# EAGLE schematic LEDPanel (EAGLE 9.6.2)
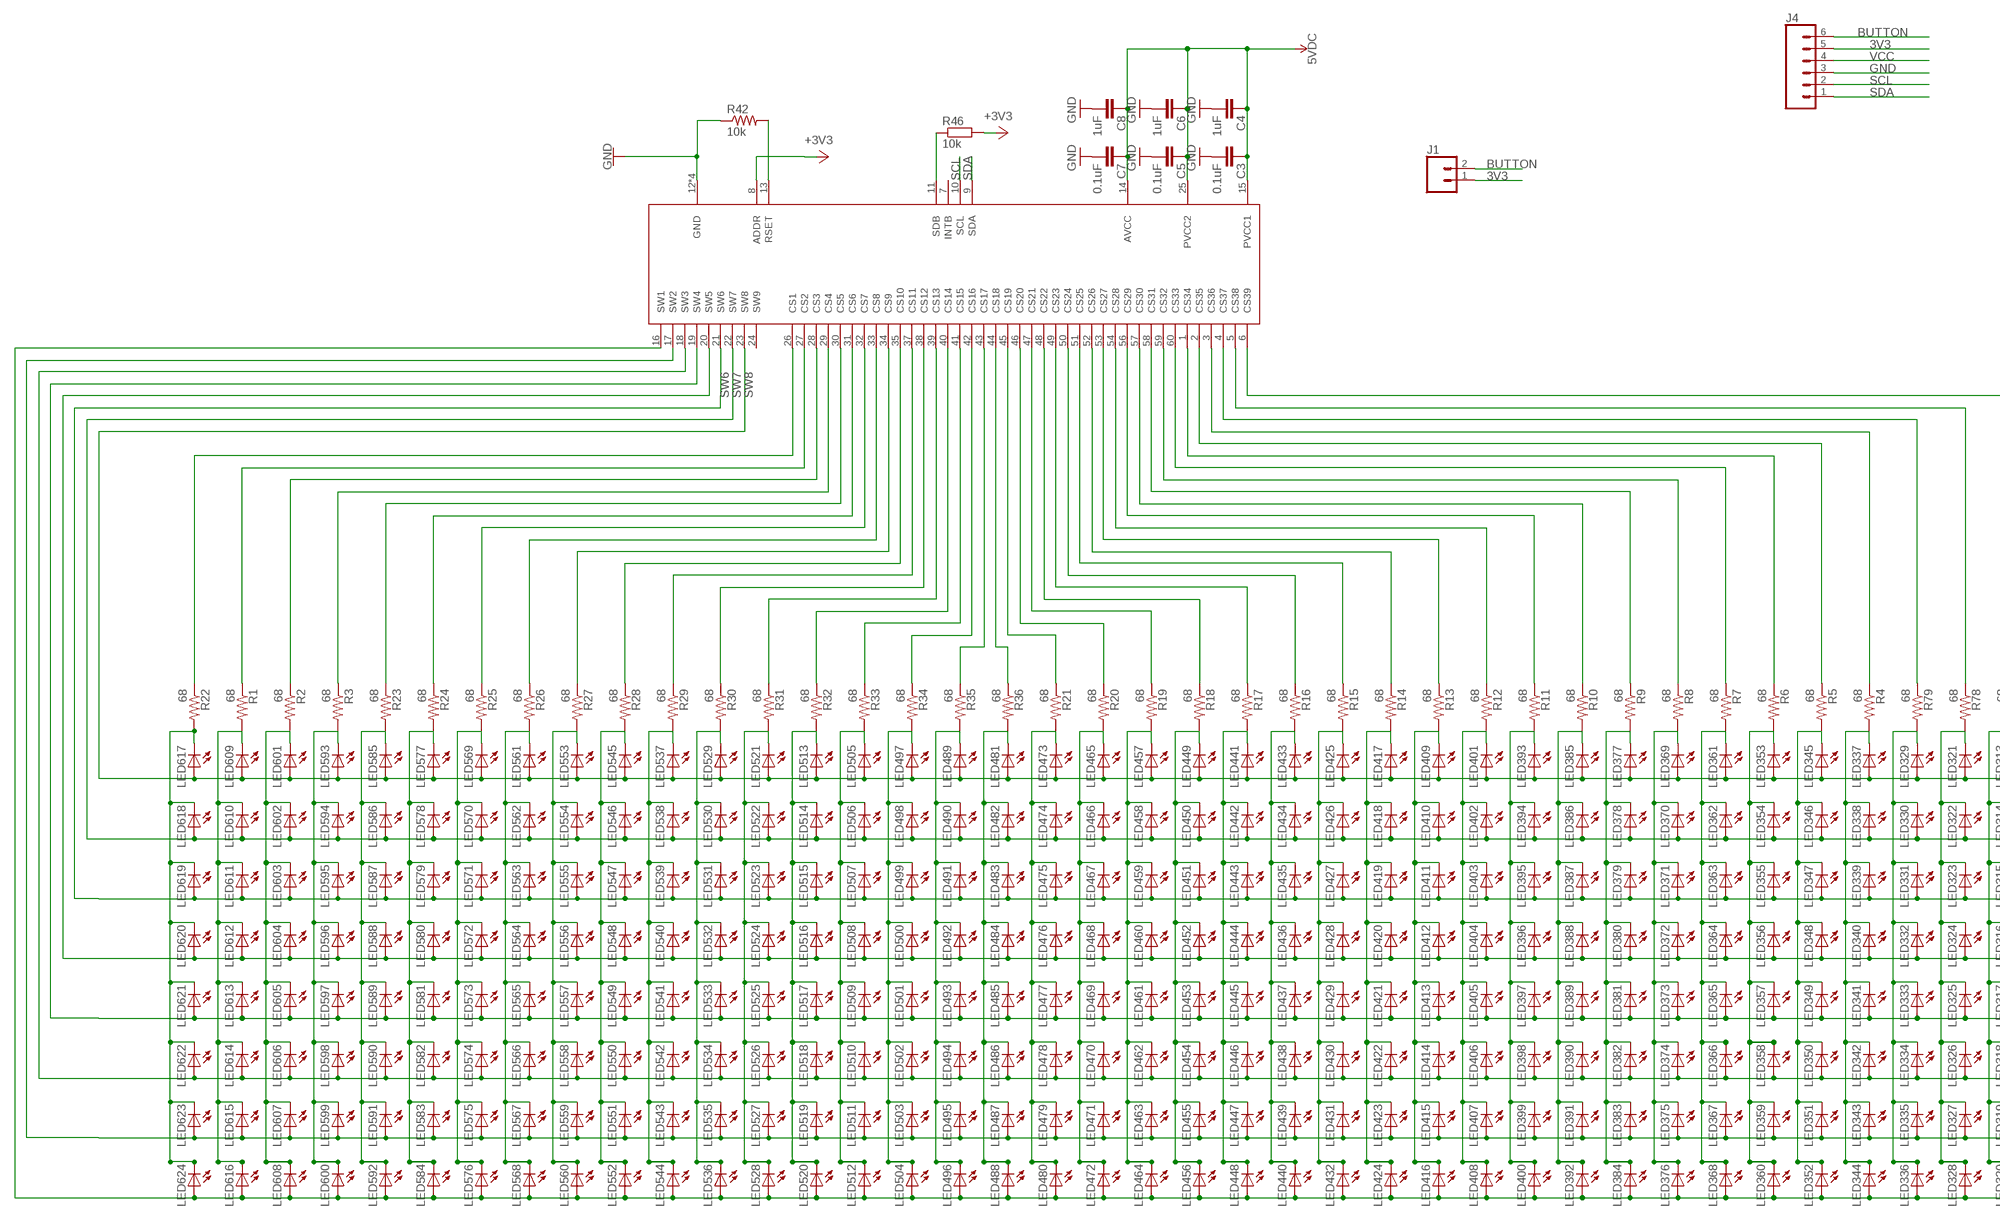
[diagram p0: schematic, sheet 1, part 1 of 2]
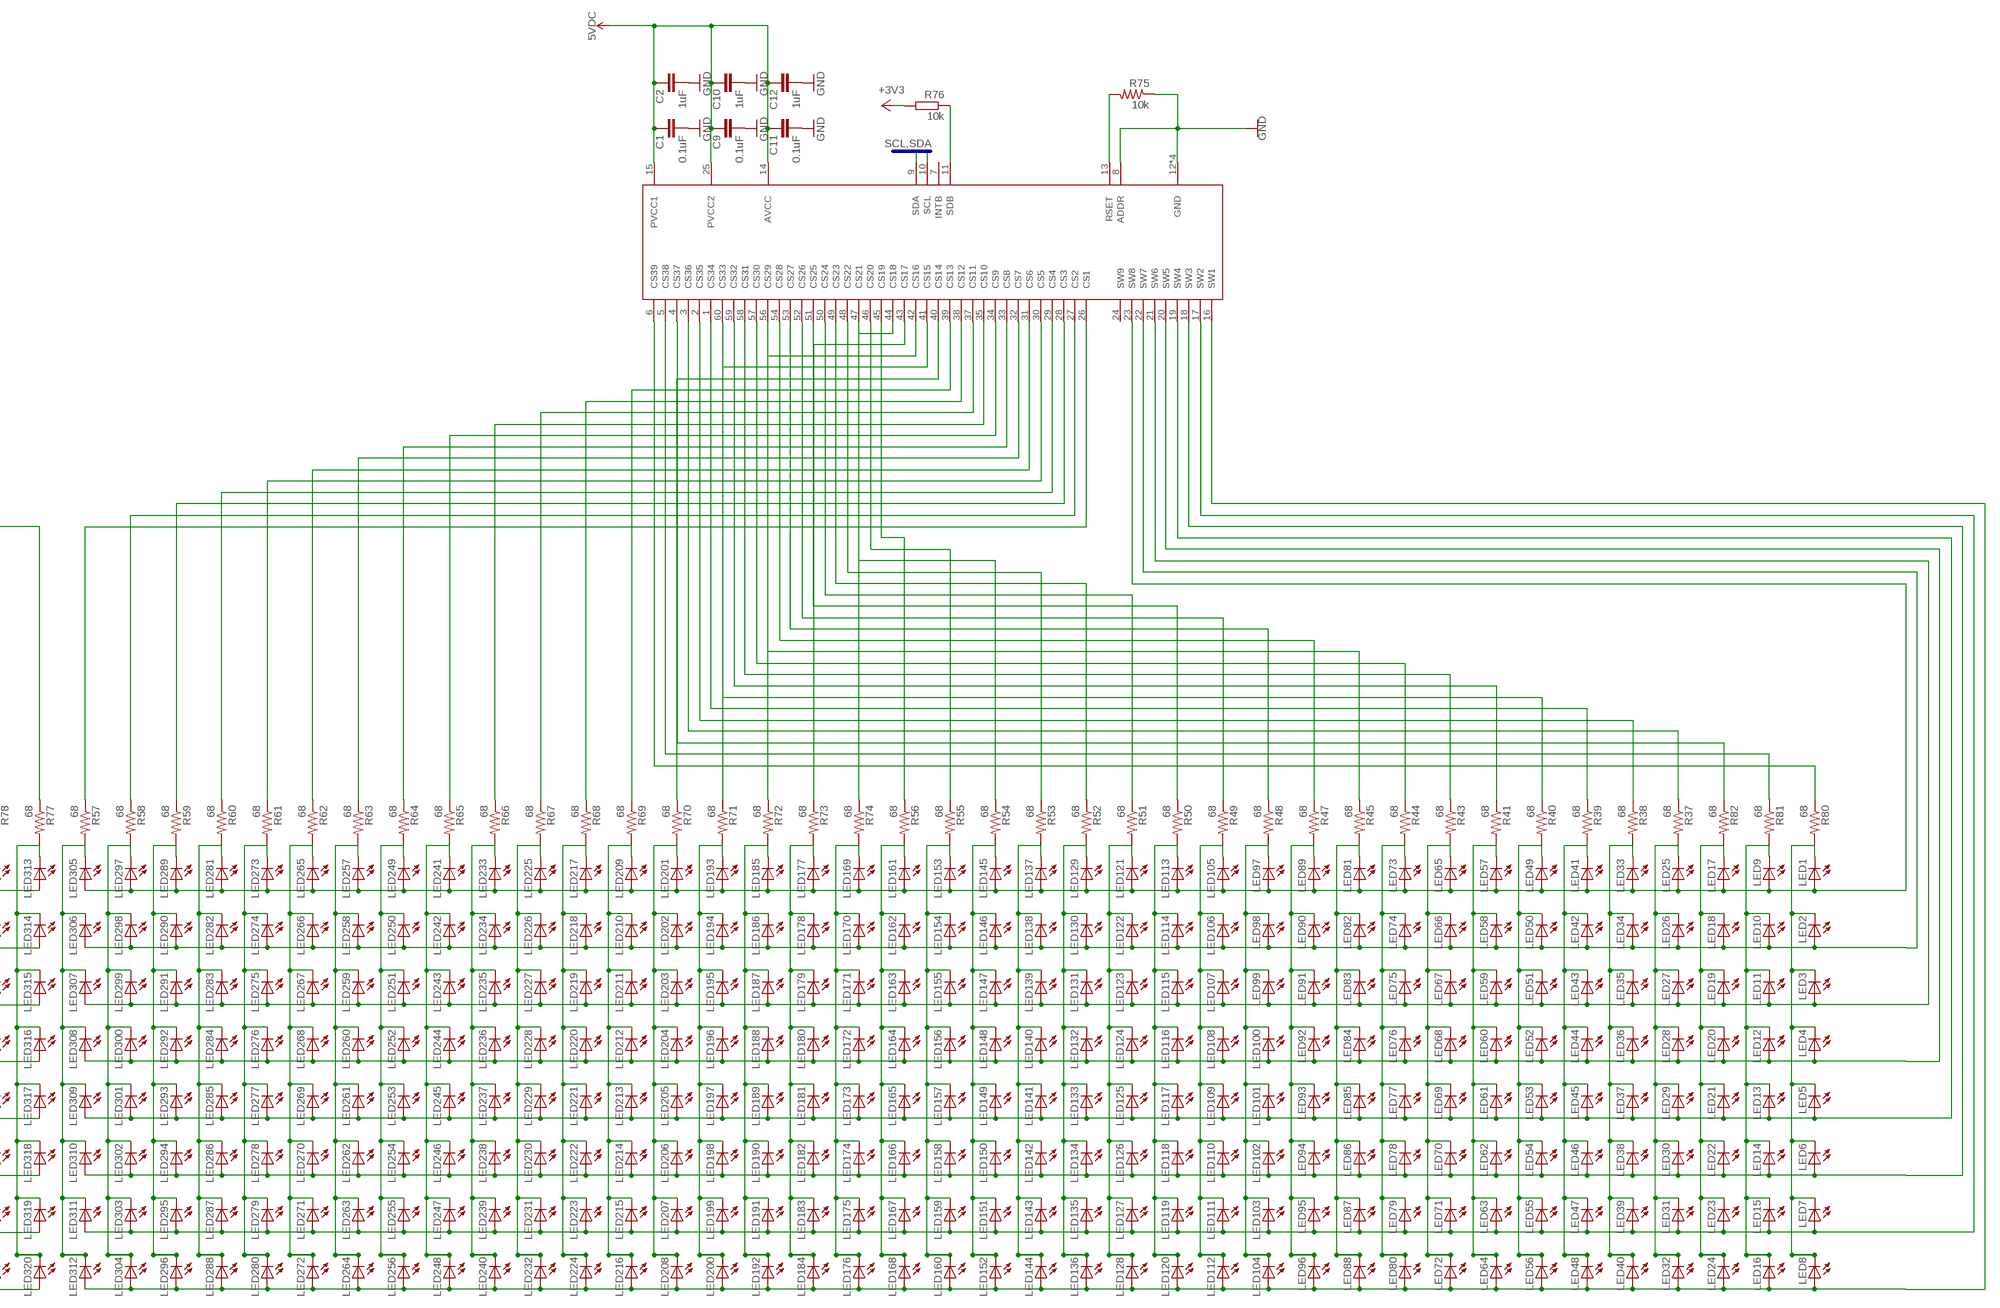
[diagram p1: schematic, sheet 1, part 2 of 2]

## Parts
C1  0.1uF  C-EUC0805K  [C0805K]
C2  1uF  C-EUC0805K  [C0805K]
C3  0.1uF  C-EUC0805K  [C0805K]
C4  1uF  C-EUC0805K  [C0805K]
C5  0.1uF  C-EUC0805K  [C0805K]
C6  1uF  C-EUC0805K  [C0805K]
C7  0.1uF  C-EUC0805K  [C0805K]
C8  1uF  C-EUC0805K  [C0805K]
C9  0.1uF  C-EUC0805K  [C0805K]
C10  1uF  C-EUC0805K  [C0805K]
C11  0.1uF  C-EUC0805K  [C0805K]
C12  1uF  C-EUC0805K  [C0805K]
J1  CONN_02LOCK  [1X02_LOCK]
J4  CONN_06LOCK  [1X06_LOCK]
LED1  LEDCHIP-LED0603  [CHIP-LED0603]
LED2  LEDCHIP-LED0603  [CHIP-LED0603]
LED3  LEDCHIP-LED0603  [CHIP-LED0603]
LED4  LEDCHIP-LED0603  [CHIP-LED0603]
LED5  LEDCHIP-LED0603  [CHIP-LED0603]
LED6  LEDCHIP-LED0603  [CHIP-LED0603]
LED7  LEDCHIP-LED0603  [CHIP-LED0603]
LED8  LEDCHIP-LED0603  [CHIP-LED0603]
LED9  LEDCHIP-LED0603  [CHIP-LED0603]
LED10  LEDCHIP-LED0603  [CHIP-LED0603]
LED11  LEDCHIP-LED0603  [CHIP-LED0603]
LED12  LEDCHIP-LED0603  [CHIP-LED0603]
LED13  LEDCHIP-LED0603  [CHIP-LED0603]
LED14  LEDCHIP-LED0603  [CHIP-LED0603]
LED15  LEDCHIP-LED0603  [CHIP-LED0603]
LED16  LEDCHIP-LED0603  [CHIP-LED0603]
LED17  LEDCHIP-LED0603  [CHIP-LED0603]
LED18  LEDCHIP-LED0603  [CHIP-LED0603]
LED19  LEDCHIP-LED0603  [CHIP-LED0603]
LED20  LEDCHIP-LED0603  [CHIP-LED0603]
LED21  LEDCHIP-LED0603  [CHIP-LED0603]
LED22  LEDCHIP-LED0603  [CHIP-LED0603]
LED23  LEDCHIP-LED0603  [CHIP-LED0603]
LED24  LEDCHIP-LED0603  [CHIP-LED0603]
LED25  LEDCHIP-LED0603  [CHIP-LED0603]
LED26  LEDCHIP-LED0603  [CHIP-LED0603]
LED27  LEDCHIP-LED0603  [CHIP-LED0603]
LED28  LEDCHIP-LED0603  [CHIP-LED0603]
LED29  LEDCHIP-LED0603  [CHIP-LED0603]
LED30  LEDCHIP-LED0603  [CHIP-LED0603]
LED31  LEDCHIP-LED0603  [CHIP-LED0603]
LED32  LEDCHIP-LED0603  [CHIP-LED0603]
LED33  LEDCHIP-LED0603  [CHIP-LED0603]
LED34  LEDCHIP-LED0603  [CHIP-LED0603]
LED35  LEDCHIP-LED0603  [CHIP-LED0603]
LED36  LEDCHIP-LED0603  [CHIP-LED0603]
LED37  LEDCHIP-LED0603  [CHIP-LED0603]
LED38  LEDCHIP-LED0603  [CHIP-LED0603]
LED39  LEDCHIP-LED0603  [CHIP-LED0603]
LED40  LEDCHIP-LED0603  [CHIP-LED0603]
LED41  LEDCHIP-LED0603  [CHIP-LED0603]
LED42  LEDCHIP-LED0603  [CHIP-LED0603]
LED43  LEDCHIP-LED0603  [CHIP-LED0603]
LED44  LEDCHIP-LED0603  [CHIP-LED0603]
LED45  LEDCHIP-LED0603  [CHIP-LED0603]
LED46  LEDCHIP-LED0603  [CHIP-LED0603]
LED47  LEDCHIP-LED0603  [CHIP-LED0603]
LED48  LEDCHIP-LED0603  [CHIP-LED0603]
LED49  LEDCHIP-LED0603  [CHIP-LED0603]
LED50  LEDCHIP-LED0603  [CHIP-LED0603]
LED51  LEDCHIP-LED0603  [CHIP-LED0603]
LED52  LEDCHIP-LED0603  [CHIP-LED0603]
LED53  LEDCHIP-LED0603  [CHIP-LED0603]
LED54  LEDCHIP-LED0603  [CHIP-LED0603]
LED55  LEDCHIP-LED0603  [CHIP-LED0603]
LED56  LEDCHIP-LED0603  [CHIP-LED0603]
LED57  LEDCHIP-LED0603  [CHIP-LED0603]
LED58  LEDCHIP-LED0603  [CHIP-LED0603]
LED59  LEDCHIP-LED0603  [CHIP-LED0603]
LED60  LEDCHIP-LED0603  [CHIP-LED0603]
LED61  LEDCHIP-LED0603  [CHIP-LED0603]
LED62  LEDCHIP-LED0603  [CHIP-LED0603]
LED63  LEDCHIP-LED0603  [CHIP-LED0603]
LED64  LEDCHIP-LED0603  [CHIP-LED0603]
LED65  LEDCHIP-LED0603  [CHIP-LED0603]
LED66  LEDCHIP-LED0603  [CHIP-LED0603]
LED67  LEDCHIP-LED0603  [CHIP-LED0603]
LED68  LEDCHIP-LED0603  [CHIP-LED0603]
LED69  LEDCHIP-LED0603  [CHIP-LED0603]
LED70  LEDCHIP-LED0603  [CHIP-LED0603]
LED71  LEDCHIP-LED0603  [CHIP-LED0603]
LED72  LEDCHIP-LED0603  [CHIP-LED0603]
LED73  LEDCHIP-LED0603  [CHIP-LED0603]
LED74  LEDCHIP-LED0603  [CHIP-LED0603]
LED75  LEDCHIP-LED0603  [CHIP-LED0603]
LED76  LEDCHIP-LED0603  [CHIP-LED0603]
LED77  LEDCHIP-LED0603  [CHIP-LED0603]
LED78  LEDCHIP-LED0603  [CHIP-LED0603]
LED79  LEDCHIP-LED0603  [CHIP-LED0603]
LED80  LEDCHIP-LED0603  [CHIP-LED0603]
LED81  LEDCHIP-LED0603  [CHIP-LED0603]
LED82  LEDCHIP-LED0603  [CHIP-LED0603]
LED83  LEDCHIP-LED0603  [CHIP-LED0603]
LED84  LEDCHIP-LED0603  [CHIP-LED0603]
LED85  LEDCHIP-LED0603  [CHIP-LED0603]
LED86  LEDCHIP-LED0603  [CHIP-LED0603]
LED87  LEDCHIP-LED0603  [CHIP-LED0603]
LED88  LEDCHIP-LED0603  [CHIP-LED0603]
LED89  LEDCHIP-LED0603  [CHIP-LED0603]
LED90  LEDCHIP-LED0603  [CHIP-LED0603]
LED91  LEDCHIP-LED0603  [CHIP-LED0603]
LED92  LEDCHIP-LED0603  [CHIP-LED0603]
LED93  LEDCHIP-LED0603  [CHIP-LED0603]
LED94  LEDCHIP-LED0603  [CHIP-LED0603]
LED95  LEDCHIP-LED0603  [CHIP-LED0603]
LED96  LEDCHIP-LED0603  [CHIP-LED0603]
LED97  LEDCHIP-LED0603  [CHIP-LED0603]
LED98  LEDCHIP-LED0603  [CHIP-LED0603]
LED99  LEDCHIP-LED0603  [CHIP-LED0603]
LED100  LEDCHIP-LED0603  [CHIP-LED0603]
LED101  LEDCHIP-LED0603  [CHIP-LED0603]
LED102  LEDCHIP-LED0603  [CHIP-LED0603]
LED103  LEDCHIP-LED0603  [CHIP-LED0603]
LED104  LEDCHIP-LED0603  [CHIP-LED0603]
LED105  LEDCHIP-LED0603  [CHIP-LED0603]
LED106  LEDCHIP-LED0603  [CHIP-LED0603]
LED107  LEDCHIP-LED0603  [CHIP-LED0603]
LED108  LEDCHIP-LED0603  [CHIP-LED0603]
LED109  LEDCHIP-LED0603  [CHIP-LED0603]
LED110  LEDCHIP-LED0603  [CHIP-LED0603]
LED111  LEDCHIP-LED0603  [CHIP-LED0603]
LED112  LEDCHIP-LED0603  [CHIP-LED0603]
LED113  LEDCHIP-LED0603  [CHIP-LED0603]
LED114  LEDCHIP-LED0603  [CHIP-LED0603]
LED115  LEDCHIP-LED0603  [CHIP-LED0603]
LED116  LEDCHIP-LED0603  [CHIP-LED0603]
LED117  LEDCHIP-LED0603  [CHIP-LED0603]
LED118  LEDCHIP-LED0603  [CHIP-LED0603]
LED119  LEDCHIP-LED0603  [CHIP-LED0603]
LED120  LEDCHIP-LED0603  [CHIP-LED0603]
LED121  LEDCHIP-LED0603  [CHIP-LED0603]
LED122  LEDCHIP-LED0603  [CHIP-LED0603]
LED123  LEDCHIP-LED0603  [CHIP-LED0603]
LED124  LEDCHIP-LED0603  [CHIP-LED0603]
LED125  LEDCHIP-LED0603  [CHIP-LED0603]
LED126  LEDCHIP-LED0603  [CHIP-LED0603]
LED127  LEDCHIP-LED0603  [CHIP-LED0603]
LED128  LEDCHIP-LED0603  [CHIP-LED0603]
LED129  LEDCHIP-LED0603  [CHIP-LED0603]
LED130  LEDCHIP-LED0603  [CHIP-LED0603]
LED131  LEDCHIP-LED0603  [CHIP-LED0603]
LED132  LEDCHIP-LED0603  [CHIP-LED0603]
LED133  LEDCHIP-LED0603  [CHIP-LED0603]
LED134  LEDCHIP-LED0603  [CHIP-LED0603]
LED135  LEDCHIP-LED0603  [CHIP-LED0603]
LED136  LEDCHIP-LED0603  [CHIP-LED0603]
LED137  LEDCHIP-LED0603  [CHIP-LED0603]
LED138  LEDCHIP-LED0603  [CHIP-LED0603]
LED139  LEDCHIP-LED0603  [CHIP-LED0603]
LED140  LEDCHIP-LED0603  [CHIP-LED0603]
LED141  LEDCHIP-LED0603  [CHIP-LED0603]
LED142  LEDCHIP-LED0603  [CHIP-LED0603]
LED143  LEDCHIP-LED0603  [CHIP-LED0603]
LED144  LEDCHIP-LED0603  [CHIP-LED0603]
LED145  LEDCHIP-LED0603  [CHIP-LED0603]
LED146  LEDCHIP-LED0603  [CHIP-LED0603]
LED147  LEDCHIP-LED0603  [CHIP-LED0603]
LED148  LEDCHIP-LED0603  [CHIP-LED0603]
LED149  LEDCHIP-LED0603  [CHIP-LED0603]
LED150  LEDCHIP-LED0603  [CHIP-LED0603]
LED151  LEDCHIP-LED0603  [CHIP-LED0603]
LED152  LEDCHIP-LED0603  [CHIP-LED0603]
LED153  LEDCHIP-LED0603  [CHIP-LED0603]
LED154  LEDCHIP-LED0603  [CHIP-LED0603]
LED155  LEDCHIP-LED0603  [CHIP-LED0603]
LED156  LEDCHIP-LED0603  [CHIP-LED0603]
LED157  LEDCHIP-LED0603  [CHIP-LED0603]
LED158  LEDCHIP-LED0603  [CHIP-LED0603]
LED159  LEDCHIP-LED0603  [CHIP-LED0603]
LED160  LEDCHIP-LED0603  [CHIP-LED0603]
LED161  LEDCHIP-LED0603  [CHIP-LED0603]
LED162  LEDCHIP-LED0603  [CHIP-LED0603]
LED163  LEDCHIP-LED0603  [CHIP-LED0603]
LED164  LEDCHIP-LED0603  [CHIP-LED0603]
LED165  LEDCHIP-LED0603  [CHIP-LED0603]
LED166  LEDCHIP-LED0603  [CHIP-LED0603]
LED167  LEDCHIP-LED0603  [CHIP-LED0603]
LED168  LEDCHIP-LED0603  [CHIP-LED0603]
LED169  LEDCHIP-LED0603  [CHIP-LED0603]
LED170  LEDCHIP-LED0603  [CHIP-LED0603]
LED171  LEDCHIP-LED0603  [CHIP-LED0603]
LED172  LEDCHIP-LED0603  [CHIP-LED0603]
LED173  LEDCHIP-LED0603  [CHIP-LED0603]
LED174  LEDCHIP-LED0603  [CHIP-LED0603]
LED175  LEDCHIP-LED0603  [CHIP-LED0603]
LED176  LEDCHIP-LED0603  [CHIP-LED0603]
LED177  LEDCHIP-LED0603  [CHIP-LED0603]
LED178  LEDCHIP-LED0603  [CHIP-LED0603]
LED179  LEDCHIP-LED0603  [CHIP-LED0603]
LED180  LEDCHIP-LED0603  [CHIP-LED0603]
LED181  LEDCHIP-LED0603  [CHIP-LED0603]
LED182  LEDCHIP-LED0603  [CHIP-LED0603]
LED183  LEDCHIP-LED0603  [CHIP-LED0603]
LED184  LEDCHIP-LED0603  [CHIP-LED0603]
LED185  LEDCHIP-LED0603  [CHIP-LED0603]
LED186  LEDCHIP-LED0603  [CHIP-LED0603]
LED187  LEDCHIP-LED0603  [CHIP-LED0603]
LED188  LEDCHIP-LED0603  [CHIP-LED0603]
LED189  LEDCHIP-LED0603  [CHIP-LED0603]
LED190  LEDCHIP-LED0603  [CHIP-LED0603]
LED191  LEDCHIP-LED0603  [CHIP-LED0603]
LED192  LEDCHIP-LED0603  [CHIP-LED0603]
LED193  LEDCHIP-LED0603  [CHIP-LED0603]
LED194  LEDCHIP-LED0603  [CHIP-LED0603]
LED195  LEDCHIP-LED0603  [CHIP-LED0603]
LED196  LEDCHIP-LED0603  [CHIP-LED0603]
LED197  LEDCHIP-LED0603  [CHIP-LED0603]
LED198  LEDCHIP-LED0603  [CHIP-LED0603]
LED199  LEDCHIP-LED0603  [CHIP-LED0603]
LED200  LEDCHIP-LED0603  [CHIP-LED0603]
LED201  LEDCHIP-LED0603  [CHIP-LED0603]
LED202  LEDCHIP-LED0603  [CHIP-LED0603]
LED203  LEDCHIP-LED0603  [CHIP-LED0603]
LED204  LEDCHIP-LED0603  [CHIP-LED0603]
LED205  LEDCHIP-LED0603  [CHIP-LED0603]
LED206  LEDCHIP-LED0603  [CHIP-LED0603]
LED207  LEDCHIP-LED0603  [CHIP-LED0603]
LED208  LEDCHIP-LED0603  [CHIP-LED0603]
LED209  LEDCHIP-LED0603  [CHIP-LED0603]
LED210  LEDCHIP-LED0603  [CHIP-LED0603]
LED211  LEDCHIP-LED0603  [CHIP-LED0603]
LED212  LEDCHIP-LED0603  [CHIP-LED0603]
LED213  LEDCHIP-LED0603  [CHIP-LED0603]
LED214  LEDCHIP-LED0603  [CHIP-LED0603]
LED215  LEDCHIP-LED0603  [CHIP-LED0603]
LED216  LEDCHIP-LED0603  [CHIP-LED0603]
LED217  LEDCHIP-LED0603  [CHIP-LED0603]
LED218  LEDCHIP-LED0603  [CHIP-LED0603]
LED219  LEDCHIP-LED0603  [CHIP-LED0603]
LED220  LEDCHIP-LED0603  [CHIP-LED0603]
LED221  LEDCHIP-LED0603  [CHIP-LED0603]
LED222  LEDCHIP-LED0603  [CHIP-LED0603]
LED223  LEDCHIP-LED0603  [CHIP-LED0603]
LED224  LEDCHIP-LED0603  [CHIP-LED0603]
LED225  LEDCHIP-LED0603  [CHIP-LED0603]
LED226  LEDCHIP-LED0603  [CHIP-LED0603]
LED227  LEDCHIP-LED0603  [CHIP-LED0603]
LED228  LEDCHIP-LED0603  [CHIP-LED0603]
LED229  LEDCHIP-LED0603  [CHIP-LED0603]
LED230  LEDCHIP-LED0603  [CHIP-LED0603]
LED231  LEDCHIP-LED0603  [CHIP-LED0603]
LED232  LEDCHIP-LED0603  [CHIP-LED0603]
LED233  LEDCHIP-LED0603  [CHIP-LED0603]
LED234  LEDCHIP-LED0603  [CHIP-LED0603]
LED235  LEDCHIP-LED0603  [CHIP-LED0603]
LED236  LEDCHIP-LED0603  [CHIP-LED0603]
LED237  LEDCHIP-LED0603  [CHIP-LED0603]
LED238  LEDCHIP-LED0603  [CHIP-LED0603]
LED239  LEDCHIP-LED0603  [CHIP-LED0603]
LED240  LEDCHIP-LED0603  [CHIP-LED0603]
LED241  LEDCHIP-LED0603  [CHIP-LED0603]
LED242  LEDCHIP-LED0603  [CHIP-LED0603]
LED243  LEDCHIP-LED0603  [CHIP-LED0603]
LED244  LEDCHIP-LED0603  [CHIP-LED0603]
LED245  LEDCHIP-LED0603  [CHIP-LED0603]
LED246  LEDCHIP-LED0603  [CHIP-LED0603]
LED247  LEDCHIP-LED0603  [CHIP-LED0603]
LED248  LEDCHIP-LED0603  [CHIP-LED0603]
LED249  LEDCHIP-LED0603  [CHIP-LED0603]
LED250  LEDCHIP-LED0603  [CHIP-LED0603]
LED251  LEDCHIP-LED0603  [CHIP-LED0603]
LED252  LEDCHIP-LED0603  [CHIP-LED0603]
LED253  LEDCHIP-LED0603  [CHIP-LED0603]
LED254  LEDCHIP-LED0603  [CHIP-LED0603]
LED255  LEDCHIP-LED0603  [CHIP-LED0603]
LED256  LEDCHIP-LED0603  [CHIP-LED0603]
LED257  LEDCHIP-LED0603  [CHIP-LED0603]
LED258  LEDCHIP-LED0603  [CHIP-LED0603]
LED259  LEDCHIP-LED0603  [CHIP-LED0603]
LED260  LEDCHIP-LED0603  [CHIP-LED0603]
LED261  LEDCHIP-LED0603  [CHIP-LED0603]
LED262  LEDCHIP-LED0603  [CHIP-LED0603]
LED263  LEDCHIP-LED0603  [CHIP-LED0603]
LED264  LEDCHIP-LED0603  [CHIP-LED0603]
LED265  LEDCHIP-LED0603  [CHIP-LED0603]
LED266  LEDCHIP-LED0603  [CHIP-LED0603]
LED267  LEDCHIP-LED0603  [CHIP-LED0603]
LED268  LEDCHIP-LED0603  [CHIP-LED0603]
LED269  LEDCHIP-LED0603  [CHIP-LED0603]
LED270  LEDCHIP-LED0603  [CHIP-LED0603]
LED271  LEDCHIP-LED0603  [CHIP-LED0603]
LED272  LEDCHIP-LED0603  [CHIP-LED0603]
LED273  LEDCHIP-LED0603  [CHIP-LED0603]
LED274  LEDCHIP-LED0603  [CHIP-LED0603]
LED275  LEDCHIP-LED0603  [CHIP-LED0603]
LED276  LEDCHIP-LED0603  [CHIP-LED0603]
LED277  LEDCHIP-LED0603  [CHIP-LED0603]
LED278  LEDCHIP-LED0603  [CHIP-LED0603]
LED279  LEDCHIP-LED0603  [CHIP-LED0603]
LED280  LEDCHIP-LED0603  [CHIP-LED0603]
LED281  LEDCHIP-LED0603  [CHIP-LED0603]
LED282  LEDCHIP-LED0603  [CHIP-LED0603]
LED283  LEDCHIP-LED0603  [CHIP-LED0603]
LED284  LEDCHIP-LED0603  [CHIP-LED0603]
LED285  LEDCHIP-LED0603  [CHIP-LED0603]
LED286  LEDCHIP-LED0603  [CHIP-LED0603]
LED287  LEDCHIP-LED0603  [CHIP-LED0603]
LED288  LEDCHIP-LED0603  [CHIP-LED0603]
LED289  LEDCHIP-LED0603  [CHIP-LED0603]
LED290  LEDCHIP-LED0603  [CHIP-LED0603]
LED291  LEDCHIP-LED0603  [CHIP-LED0603]
LED292  LEDCHIP-LED0603  [CHIP-LED0603]
LED293  LEDCHIP-LED0603  [CHIP-LED0603]
LED294  LEDCHIP-LED0603  [CHIP-LED0603]
LED295  LEDCHIP-LED0603  [CHIP-LED0603]
LED296  LEDCHIP-LED0603  [CHIP-LED0603]
LED297  LEDCHIP-LED0603  [CHIP-LED0603]
LED298  LEDCHIP-LED0603  [CHIP-LED0603]
LED299  LEDCHIP-LED0603  [CHIP-LED0603]
LED300  LEDCHIP-LED0603  [CHIP-LED0603]
LED301  LEDCHIP-LED0603  [CHIP-LED0603]
LED302  LEDCHIP-LED0603  [CHIP-LED0603]
LED303  LEDCHIP-LED0603  [CHIP-LED0603]
LED304  LEDCHIP-LED0603  [CHIP-LED0603]
LED305  LEDCHIP-LED0603  [CHIP-LED0603]
LED306  LEDCHIP-LED0603  [CHIP-LED0603]
LED307  LEDCHIP-LED0603  [CHIP-LED0603]
LED308  LEDCHIP-LED0603  [CHIP-LED0603]
LED309  LEDCHIP-LED0603  [CHIP-LED0603]
LED310  LEDCHIP-LED0603  [CHIP-LED0603]
LED311  LEDCHIP-LED0603  [CHIP-LED0603]
LED312  LEDCHIP-LED0603  [CHIP-LED0603]
LED313  LEDCHIP-LED0603  [CHIP-LED0603]
LED314  LEDCHIP-LED0603  [CHIP-LED0603]
LED315  LEDCHIP-LED0603  [CHIP-LED0603]
LED316  LEDCHIP-LED0603  [CHIP-LED0603]
LED317  LEDCHIP-LED0603  [CHIP-LED0603]
LED318  LEDCHIP-LED0603  [CHIP-LED0603]
LED319  LEDCHIP-LED0603  [CHIP-LED0603]
LED320  LEDCHIP-LED0603  [CHIP-LED0603]
LED321  LEDCHIP-LED0603  [CHIP-LED0603]
LED322  LEDCHIP-LED0603  [CHIP-LED0603]
LED323  LEDCHIP-LED0603  [CHIP-LED0603]
LED324  LEDCHIP-LED0603  [CHIP-LED0603]
LED325  LEDCHIP-LED0603  [CHIP-LED0603]
LED326  LEDCHIP-LED0603  [CHIP-LED0603]
LED327  LEDCHIP-LED0603  [CHIP-LED0603]
LED328  LEDCHIP-LED0603  [CHIP-LED0603]
LED329  LEDCHIP-LED0603  [CHIP-LED0603]
LED330  LEDCHIP-LED0603  [CHIP-LED0603]
LED331  LEDCHIP-LED0603  [CHIP-LED0603]
LED332  LEDCHIP-LED0603  [CHIP-LED0603]
LED333  LEDCHIP-LED0603  [CHIP-LED0603]
LED334  LEDCHIP-LED0603  [CHIP-LED0603]
LED335  LEDCHIP-LED0603  [CHIP-LED0603]
LED336  LEDCHIP-LED0603  [CHIP-LED0603]
LED337  LEDCHIP-LED0603  [CHIP-LED0603]
LED338  LEDCHIP-LED0603  [CHIP-LED0603]
LED339  LEDCHIP-LED0603  [CHIP-LED0603]
LED340  LEDCHIP-LED0603  [CHIP-LED0603]
LED341  LEDCHIP-LED0603  [CHIP-LED0603]
LED342  LEDCHIP-LED0603  [CHIP-LED0603]
LED343  LEDCHIP-LED0603  [CHIP-LED0603]
LED344  LEDCHIP-LED0603  [CHIP-LED0603]
LED345  LEDCHIP-LED0603  [CHIP-LED0603]
LED346  LEDCHIP-LED0603  [CHIP-LED0603]
LED347  LEDCHIP-LED0603  [CHIP-LED0603]
LED348  LEDCHIP-LED0603  [CHIP-LED0603]
LED349  LEDCHIP-LED0603  [CHIP-LED0603]
LED350  LEDCHIP-LED0603  [CHIP-LED0603]
LED351  LEDCHIP-LED0603  [CHIP-LED0603]
LED352  LEDCHIP-LED0603  [CHIP-LED0603]
LED353  LEDCHIP-LED0603  [CHIP-LED0603]
LED354  LEDCHIP-LED0603  [CHIP-LED0603]
LED355  LEDCHIP-LED0603  [CHIP-LED0603]
LED356  LEDCHIP-LED0603  [CHIP-LED0603]
LED357  LEDCHIP-LED0603  [CHIP-LED0603]
LED358  LEDCHIP-LED0603  [CHIP-LED0603]
LED359  LEDCHIP-LED0603  [CHIP-LED0603]
LED360  LEDCHIP-LED0603  [CHIP-LED0603]
LED361  LEDCHIP-LED0603  [CHIP-LED0603]
LED362  LEDCHIP-LED0603  [CHIP-LED0603]
LED363  LEDCHIP-LED0603  [CHIP-LED0603]
LED364  LEDCHIP-LED0603  [CHIP-LED0603]
LED365  LEDCHIP-LED0603  [CHIP-LED0603]
LED366  LEDCHIP-LED0603  [CHIP-LED0603]
LED367  LEDCHIP-LED0603  [CHIP-LED0603]
LED368  LEDCHIP-LED0603  [CHIP-LED0603]
LED369  LEDCHIP-LED0603  [CHIP-LED0603]
LED370  LEDCHIP-LED0603  [CHIP-LED0603]
LED371  LEDCHIP-LED0603  [CHIP-LED0603]
LED372  LEDCHIP-LED0603  [CHIP-LED0603]
LED373  LEDCHIP-LED0603  [CHIP-LED0603]
LED374  LEDCHIP-LED0603  [CHIP-LED0603]
LED375  LEDCHIP-LED0603  [CHIP-LED0603]
LED376  LEDCHIP-LED0603  [CHIP-LED0603]
LED377  LEDCHIP-LED0603  [CHIP-LED0603]
LED378  LEDCHIP-LED0603  [CHIP-LED0603]
LED379  LEDCHIP-LED0603  [CHIP-LED0603]
LED380  LEDCHIP-LED0603  [CHIP-LED0603]
LED381  LEDCHIP-LED0603  [CHIP-LED0603]
LED382  LEDCHIP-LED0603  [CHIP-LED0603]
LED383  LEDCHIP-LED0603  [CHIP-LED0603]
LED384  LEDCHIP-LED0603  [CHIP-LED0603]
LED385  LEDCHIP-LED0603  [CHIP-LED0603]
LED386  LEDCHIP-LED0603  [CHIP-LED0603]
LED387  LEDCHIP-LED0603  [CHIP-LED0603]
LED388  LEDCHIP-LED0603  [CHIP-LED0603]
LED389  LEDCHIP-LED0603  [CHIP-LED0603]
LED390  LEDCHIP-LED0603  [CHIP-LED0603]
LED391  LEDCHIP-LED0603  [CHIP-LED0603]
LED392  LEDCHIP-LED0603  [CHIP-LED0603]
LED393  LEDCHIP-LED0603  [CHIP-LED0603]
LED394  LEDCHIP-LED0603  [CHIP-LED0603]
LED395  LEDCHIP-LED0603  [CHIP-LED0603]
LED396  LEDCHIP-LED0603  [CHIP-LED0603]
LED397  LEDCHIP-LED0603  [CHIP-LED0603]
LED398  LEDCHIP-LED0603  [CHIP-LED0603]
LED399  LEDCHIP-LED0603  [CHIP-LED0603]
LED400  LEDCHIP-LED0603  [CHIP-LED0603]
LED401  LEDCHIP-LED0603  [CHIP-LED0603]
LED402  LEDCHIP-LED0603  [CHIP-LED0603]
LED403  LEDCHIP-LED0603  [CHIP-LED0603]
LED404  LEDCHIP-LED0603  [CHIP-LED0603]
LED405  LEDCHIP-LED0603  [CHIP-LED0603]
LED406  LEDCHIP-LED0603  [CHIP-LED0603]
LED407  LEDCHIP-LED0603  [CHIP-LED0603]
LED408  LEDCHIP-LED0603  [CHIP-LED0603]
LED409  LEDCHIP-LED0603  [CHIP-LED0603]
LED410  LEDCHIP-LED0603  [CHIP-LED0603]
LED411  LEDCHIP-LED0603  [CHIP-LED0603]
LED412  LEDCHIP-LED0603  [CHIP-LED0603]
LED413  LEDCHIP-LED0603  [CHIP-LED0603]
LED414  LEDCHIP-LED0603  [CHIP-LED0603]
LED415  LEDCHIP-LED0603  [CHIP-LED0603]
LED416  LEDCHIP-LED0603  [CHIP-LED0603]
LED417  LEDCHIP-LED0603  [CHIP-LED0603]
LED418  LEDCHIP-LED0603  [CHIP-LED0603]
LED419  LEDCHIP-LED0603  [CHIP-LED0603]
LED420  LEDCHIP-LED0603  [CHIP-LED0603]
LED421  LEDCHIP-LED0603  [CHIP-LED0603]
LED422  LEDCHIP-LED0603  [CHIP-LED0603]
LED423  LEDCHIP-LED0603  [CHIP-LED0603]
LED424  LEDCHIP-LED0603  [CHIP-LED0603]
LED425  LEDCHIP-LED0603  [CHIP-LED0603]
LED426  LEDCHIP-LED0603  [CHIP-LED0603]
LED427  LEDCHIP-LED0603  [CHIP-LED0603]
LED428  LEDCHIP-LED0603  [CHIP-LED0603]
LED429  LEDCHIP-LED0603  [CHIP-LED0603]
LED430  LEDCHIP-LED0603  [CHIP-LED0603]
LED431  LEDCHIP-LED0603  [CHIP-LED0603]
LED432  LEDCHIP-LED0603  [CHIP-LED0603]
LED433  LEDCHIP-LED0603  [CHIP-LED0603]
LED434  LEDCHIP-LED0603  [CHIP-LED0603]
LED435  LEDCHIP-LED0603  [CHIP-LED0603]
LED436  LEDCHIP-LED0603  [CHIP-LED0603]
LED437  LEDCHIP-LED0603  [CHIP-LED0603]
LED438  LEDCHIP-LED0603  [CHIP-LED0603]
LED439  LEDCHIP-LED0603  [CHIP-LED0603]
LED440  LEDCHIP-LED0603  [CHIP-LED0603]
LED441  LEDCHIP-LED0603  [CHIP-LED0603]
LED442  LEDCHIP-LED0603  [CHIP-LED0603]
LED443  LEDCHIP-LED0603  [CHIP-LED0603]
LED444  LEDCHIP-LED0603  [CHIP-LED0603]
LED445  LEDCHIP-LED0603  [CHIP-LED0603]
LED446  LEDCHIP-LED0603  [CHIP-LED0603]
LED447  LEDCHIP-LED0603  [CHIP-LED0603]
LED448  LEDCHIP-LED0603  [CHIP-LED0603]
LED449  LEDCHIP-LED0603  [CHIP-LED0603]
LED450  LEDCHIP-LED0603  [CHIP-LED0603]
LED451  LEDCHIP-LED0603  [CHIP-LED0603]
LED452  LEDCHIP-LED0603  [CHIP-LED0603]
LED453  LEDCHIP-LED0603  [CHIP-LED0603]
LED454  LEDCHIP-LED0603  [CHIP-LED0603]
LED455  LEDCHIP-LED0603  [CHIP-LED0603]
LED456  LEDCHIP-LED0603  [CHIP-LED0603]
LED457  LEDCHIP-LED0603  [CHIP-LED0603]
LED458  LEDCHIP-LED0603  [CHIP-LED0603]
LED459  LEDCHIP-LED0603  [CHIP-LED0603]
LED460  LEDCHIP-LED0603  [CHIP-LED0603]
LED461  LEDCHIP-LED0603  [CHIP-LED0603]
LED462  LEDCHIP-LED0603  [CHIP-LED0603]
LED463  LEDCHIP-LED0603  [CHIP-LED0603]
LED464  LEDCHIP-LED0603  [CHIP-LED0603]
LED465  LEDCHIP-LED0603  [CHIP-LED0603]
LED466  LEDCHIP-LED0603  [CHIP-LED0603]
LED467  LEDCHIP-LED0603  [CHIP-LED0603]
LED468  LEDCHIP-LED0603  [CHIP-LED0603]
LED469  LEDCHIP-LED0603  [CHIP-LED0603]
LED470  LEDCHIP-LED0603  [CHIP-LED0603]
LED471  LEDCHIP-LED0603  [CHIP-LED0603]
LED472  LEDCHIP-LED0603  [CHIP-LED0603]
LED473  LEDCHIP-LED0603  [CHIP-LED0603]
LED474  LEDCHIP-LED0603  [CHIP-LED0603]
LED475  LEDCHIP-LED0603  [CHIP-LED0603]
LED476  LEDCHIP-LED0603  [CHIP-LED0603]
LED477  LEDCHIP-LED0603  [CHIP-LED0603]
LED478  LEDCHIP-LED0603  [CHIP-LED0603]
LED479  LEDCHIP-LED0603  [CHIP-LED0603]
LED480  LEDCHIP-LED0603  [CHIP-LED0603]
LED481  LEDCHIP-LED0603  [CHIP-LED0603]
LED482  LEDCHIP-LED0603  [CHIP-LED0603]
LED483  LEDCHIP-LED0603  [CHIP-LED0603]
LED484  LEDCHIP-LED0603  [CHIP-LED0603]
LED485  LEDCHIP-LED0603  [CHIP-LED0603]
LED486  LEDCHIP-LED0603  [CHIP-LED0603]
LED487  LEDCHIP-LED0603  [CHIP-LED0603]
LED488  LEDCHIP-LED0603  [CHIP-LED0603]
LED489  LEDCHIP-LED0603  [CHIP-LED0603]
LED490  LEDCHIP-LED0603  [CHIP-LED0603]
LED491  LEDCHIP-LED0603  [CHIP-LED0603]
LED492  LEDCHIP-LED0603  [CHIP-LED0603]
LED493  LEDCHIP-LED0603  [CHIP-LED0603]
LED494  LEDCHIP-LED0603  [CHIP-LED0603]
LED495  LEDCHIP-LED0603  [CHIP-LED0603]
LED496  LEDCHIP-LED0603  [CHIP-LED0603]
LED497  LEDCHIP-LED0603  [CHIP-LED0603]
LED498  LEDCHIP-LED0603  [CHIP-LED0603]
LED499  LEDCHIP-LED0603  [CHIP-LED0603]
LED500  LEDCHIP-LED0603  [CHIP-LED0603]
LED501  LEDCHIP-LED0603  [CHIP-LED0603]
LED502  LEDCHIP-LED0603  [CHIP-LED0603]
LED503  LEDCHIP-LED0603  [CHIP-LED0603]
LED504  LEDCHIP-LED0603  [CHIP-LED0603]
LED505  LEDCHIP-LED0603  [CHIP-LED0603]
LED506  LEDCHIP-LED0603  [CHIP-LED0603]
LED507  LEDCHIP-LED0603  [CHIP-LED0603]
LED508  LEDCHIP-LED0603  [CHIP-LED0603]
LED509  LEDCHIP-LED0603  [CHIP-LED0603]
LED510  LEDCHIP-LED0603  [CHIP-LED0603]
LED511  LEDCHIP-LED0603  [CHIP-LED0603]
LED512  LEDCHIP-LED0603  [CHIP-LED0603]
LED513  LEDCHIP-LED0603  [CHIP-LED0603]
LED514  LEDCHIP-LED0603  [CHIP-LED0603]
LED515  LEDCHIP-LED0603  [CHIP-LED0603]
LED516  LEDCHIP-LED0603  [CHIP-LED0603]
LED517  LEDCHIP-LED0603  [CHIP-LED0603]
LED518  LEDCHIP-LED0603  [CHIP-LED0603]
LED519  LEDCHIP-LED0603  [CHIP-LED0603]
LED520  LEDCHIP-LED0603  [CHIP-LED0603]
LED521  LEDCHIP-LED0603  [CHIP-LED0603]
LED522  LEDCHIP-LED0603  [CHIP-LED0603]
LED523  LEDCHIP-LED0603  [CHIP-LED0603]
LED524  LEDCHIP-LED0603  [CHIP-LED0603]
LED525  LEDCHIP-LED0603  [CHIP-LED0603]
LED526  LEDCHIP-LED0603  [CHIP-LED0603]
LED527  LEDCHIP-LED0603  [CHIP-LED0603]
LED528  LEDCHIP-LED0603  [CHIP-LED0603]
LED529  LEDCHIP-LED0603  [CHIP-LED0603]
LED530  LEDCHIP-LED0603  [CHIP-LED0603]
LED531  LEDCHIP-LED0603  [CHIP-LED0603]
LED532  LEDCHIP-LED0603  [CHIP-LED0603]
LED533  LEDCHIP-LED0603  [CHIP-LED0603]
LED534  LEDCHIP-LED0603  [CHIP-LED0603]
LED535  LEDCHIP-LED0603  [CHIP-LED0603]
LED536  LEDCHIP-LED0603  [CHIP-LED0603]
LED537  LEDCHIP-LED0603  [CHIP-LED0603]
LED538  LEDCHIP-LED0603  [CHIP-LED0603]
LED539  LEDCHIP-LED0603  [CHIP-LED0603]
LED540  LEDCHIP-LED0603  [CHIP-LED0603]
LED541  LEDCHIP-LED0603  [CHIP-LED0603]
LED542  LEDCHIP-LED0603  [CHIP-LED0603]
LED543  LEDCHIP-LED0603  [CHIP-LED0603]
LED544  LEDCHIP-LED0603  [CHIP-LED0603]
LED545  LEDCHIP-LED0603  [CHIP-LED0603]
LED546  LEDCHIP-LED0603  [CHIP-LED0603]
LED547  LEDCHIP-LED0603  [CHIP-LED0603]
LED548  LEDCHIP-LED0603  [CHIP-LED0603]
LED549  LEDCHIP-LED0603  [CHIP-LED0603]
LED550  LEDCHIP-LED0603  [CHIP-LED0603]
LED551  LEDCHIP-LED0603  [CHIP-LED0603]
LED552  LEDCHIP-LED0603  [CHIP-LED0603]
LED553  LEDCHIP-LED0603  [CHIP-LED0603]
LED554  LEDCHIP-LED0603  [CHIP-LED0603]
LED555  LEDCHIP-LED0603  [CHIP-LED0603]
LED556  LEDCHIP-LED0603  [CHIP-LED0603]
LED557  LEDCHIP-LED0603  [CHIP-LED0603]
LED558  LEDCHIP-LED0603  [CHIP-LED0603]
LED559  LEDCHIP-LED0603  [CHIP-LED0603]
LED560  LEDCHIP-LED0603  [CHIP-LED0603]
LED561  LEDCHIP-LED0603  [CHIP-LED0603]
LED562  LEDCHIP-LED0603  [CHIP-LED0603]
LED563  LEDCHIP-LED0603  [CHIP-LED0603]
LED564  LEDCHIP-LED0603  [CHIP-LED0603]
LED565  LEDCHIP-LED0603  [CHIP-LED0603]
LED566  LEDCHIP-LED0603  [CHIP-LED0603]
LED567  LEDCHIP-LED0603  [CHIP-LED0603]
LED568  LEDCHIP-LED0603  [CHIP-LED0603]
LED569  LEDCHIP-LED0603  [CHIP-LED0603]
LED570  LEDCHIP-LED0603  [CHIP-LED0603]
LED571  LEDCHIP-LED0603  [CHIP-LED0603]
LED572  LEDCHIP-LED0603  [CHIP-LED0603]
LED573  LEDCHIP-LED0603  [CHIP-LED0603]
LED574  LEDCHIP-LED0603  [CHIP-LED0603]
LED575  LEDCHIP-LED0603  [CHIP-LED0603]
LED576  LEDCHIP-LED0603  [CHIP-LED0603]
LED577  LEDCHIP-LED0603  [CHIP-LED0603]
LED578  LEDCHIP-LED0603  [CHIP-LED0603]
LED579  LEDCHIP-LED0603  [CHIP-LED0603]
LED580  LEDCHIP-LED0603  [CHIP-LED0603]
LED581  LEDCHIP-LED0603  [CHIP-LED0603]
LED582  LEDCHIP-LED0603  [CHIP-LED0603]
LED583  LEDCHIP-LED0603  [CHIP-LED0603]
LED584  LEDCHIP-LED0603  [CHIP-LED0603]
LED585  LEDCHIP-LED0603  [CHIP-LED0603]
LED586  LEDCHIP-LED0603  [CHIP-LED0603]
LED587  LEDCHIP-LED0603  [CHIP-LED0603]
LED588  LEDCHIP-LED0603  [CHIP-LED0603]
LED589  LEDCHIP-LED0603  [CHIP-LED0603]
LED590  LEDCHIP-LED0603  [CHIP-LED0603]
LED591  LEDCHIP-LED0603  [CHIP-LED0603]
LED592  LEDCHIP-LED0603  [CHIP-LED0603]
LED593  LEDCHIP-LED0603  [CHIP-LED0603]
LED594  LEDCHIP-LED0603  [CHIP-LED0603]
LED595  LEDCHIP-LED0603  [CHIP-LED0603]
LED596  LEDCHIP-LED0603  [CHIP-LED0603]
LED597  LEDCHIP-LED0603  [CHIP-LED0603]
LED598  LEDCHIP-LED0603  [CHIP-LED0603]
LED599  LEDCHIP-LED0603  [CHIP-LED0603]
LED600  LEDCHIP-LED0603  [CHIP-LED0603]
LED601  LEDCHIP-LED0603  [CHIP-LED0603]
LED602  LEDCHIP-LED0603  [CHIP-LED0603]
LED603  LEDCHIP-LED0603  [CHIP-LED0603]
LED604  LEDCHIP-LED0603  [CHIP-LED0603]
LED605  LEDCHIP-LED0603  [CHIP-LED0603]
LED606  LEDCHIP-LED0603  [CHIP-LED0603]
LED607  LEDCHIP-LED0603  [CHIP-LED0603]
LED608  LEDCHIP-LED0603  [CHIP-LED0603]
LED609  LEDCHIP-LED0603  [CHIP-LED0603]
LED610  LEDCHIP-LED0603  [CHIP-LED0603]
LED611  LEDCHIP-LED0603  [CHIP-LED0603]
LED612  LEDCHIP-LED0603  [CHIP-LED0603]
LED613  LEDCHIP-LED0603  [CHIP-LED0603]
LED614  LEDCHIP-LED0603  [CHIP-LED0603]
LED615  LEDCHIP-LED0603  [CHIP-LED0603]
LED616  LEDCHIP-LED0603  [CHIP-LED0603]
LED617  LEDCHIP-LED0603  [CHIP-LED0603]
LED618  LEDCHIP-LED0603  [CHIP-LED0603]
LED619  LEDCHIP-LED0603  [CHIP-LED0603]
LED620  LEDCHIP-LED0603  [CHIP-LED0603]
LED621  LEDCHIP-LED0603  [CHIP-LED0603]
LED622  LEDCHIP-LED0603  [CHIP-LED0603]
LED623  LEDCHIP-LED0603  [CHIP-LED0603]
LED624  LEDCHIP-LED0603  [CHIP-LED0603]
R1  68  R-US_R0805  [R0805]
R2  68  R-US_R0805  [R0805]
R3  68  R-US_R0805  [R0805]
R4  68  R-US_R0805  [R0805]
R5  68  R-US_R0805  [R0805]
R6  68  R-US_R0805  [R0805]
R7  68  R-US_R0805  [R0805]
R8  68  R-US_R0805  [R0805]
R9  68  R-US_R0805  [R0805]
R10  68  R-US_R0805  [R0805]
R11  68  R-US_R0805  [R0805]
R12  68  R-US_R0805  [R0805]
R13  68  R-US_R0805  [R0805]
R14  68  R-US_R0805  [R0805]
R15  68  R-US_R0805  [R0805]
R16  68  R-US_R0805  [R0805]
R17  68  R-US_R0805  [R0805]
R18  68  R-US_R0805  [R0805]
R19  68  R-US_R0805  [R0805]
R20  68  R-US_R0805  [R0805]
R21  68  R-US_R0805  [R0805]
R22  68  R-US_R0805  [R0805]
R23  68  R-US_R0805  [R0805]
R24  68  R-US_R0805  [R0805]
R25  68  R-US_R0805  [R0805]
R26  68  R-US_R0805  [R0805]
R27  68  R-US_R0805  [R0805]
R28  68  R-US_R0805  [R0805]
R29  68  R-US_R0805  [R0805]
R30  68  R-US_R0805  [R0805]
R31  68  R-US_R0805  [R0805]
R32  68  R-US_R0805  [R0805]
R33  68  R-US_R0805  [R0805]
R34  68  R-US_R0805  [R0805]
R35  68  R-US_R0805  [R0805]
R36  68  R-US_R0805  [R0805]
R37  68  R-US_R0805  [R0805]
R38  68  R-US_R0805  [R0805]
R39  68  R-US_R0805  [R0805]
R40  68  R-US_R0805  [R0805]
R41  68  R-US_R0805  [R0805]
R42  10k  R-US_R0805  [R0805]
R43  68  R-US_R0805  [R0805]
R44  68  R-US_R0805  [R0805]
R45  68  R-US_R0805  [R0805]
R46  10k  R-EU_R0805  [R0805]
R47  68  R-US_R0805  [R0805]
R48  68  R-US_R0805  [R0805]
R49  68  R-US_R0805  [R0805]
R50  68  R-US_R0805  [R0805]
R51  68  R-US_R0805  [R0805]
R52  68  R-US_R0805  [R0805]
R53  68  R-US_R0805  [R0805]
R54  68  R-US_R0805  [R0805]
R55  68  R-US_R0805  [R0805]
R56  68  R-US_R0805  [R0805]
R57  68  R-US_R0805  [R0805]
R58  68  R-US_R0805  [R0805]
R59  68  R-US_R0805  [R0805]
R60  68  R-US_R0805  [R0805]
R61  68  R-US_R0805  [R0805]
R62  68  R-US_R0805  [R0805]
R63  68  R-US_R0805  [R0805]
R64  68  R-US_R0805  [R0805]
R65  68  R-US_R0805  [R0805]
R66  68  R-US_R0805  [R0805]
R67  68  R-US_R0805  [R0805]
R68  68  R-US_R0805  [R0805]
R69  68  R-US_R0805  [R0805]
R70  68  R-US_R0805  [R0805]
R71  68  R-US_R0805  [R0805]
R72  68  R-US_R0805  [R0805]
R73  68  R-US_R0805  [R0805]
R74  68  R-US_R0805  [R0805]
R75  10k  R-US_R0805  [R0805]
R76  10k  R-EU_R0805  [R0805]
R77  68  R-US_R0805  [R0805]
R78  68  R-US_R0805  [R0805]
R79  68  R-US_R0805  [R0805]
R80  68  R-US_R0805  [R0805]
R81  68  R-US_R0805  [R0805]
R82  68  R-US_R0805  [R0805]
U1  IS31FL3741_QFN60  [QFN60]
U2  IS31FL3741_QFN60  [QFN60]

## Nets
3V3: J1.1 J4.5 R46.2 R76.2 U1.8(ADDR) ; supply symbol labelled +3V3
BUTTON: J1.2 J4.6
GND: C1.2 C2.2 C3.2 C4.2 C5.2 C6.2 C7.2 C8.2 C9.2 C10.2 C11.2 C12.2 J4.3 R42.1 R75.1 U1.12(GND) U1.36(GND) U1.55(GND) U1.PAD(GND) U2.8(ADDR) U2.12(GND) U2.36(GND) U2.55(GND) U2.PAD(GND)
N$1: R57.1 U2.26(CS1)
N$2: R58.1 U2.27(CS2)
N$3: R59.1 U2.28(CS3)
N$4: R60.1 U2.29(CS4)
N$5: R61.1 U2.30(CS5)
N$6: R62.1 U2.31(CS6)
N$7: R63.1 U2.32(CS7)
N$8: R64.1 U2.33(CS8)
N$9: R65.1 U2.34(CS9)
N$10: R66.1 U2.35(CS10)
N$11: R67.1 U2.37(CS11)
N$12: R68.1 U2.38(CS12)
N$13: R69.1 U2.39(CS13)
N$14: R70.1 U2.40(CS14)
N$15: R71.1 U2.41(CS15)
N$16: R72.1 U2.42(CS16)
N$17: R73.1 U2.43(CS17)
N$18: R74.1 U2.44(CS18)
N$19: R56.1 U2.45(CS19)
N$20: R55.1 U2.46(CS20)
N$21: R54.1 U2.47(CS21)
N$22: R53.1 U2.48(CS22)
N$23: R52.1 U2.49(CS23)
N$24: R51.1 U2.50(CS24)
N$25: R50.1 U2.51(CS25)
N$26: R49.1 U2.52(CS26)
N$27: R48.1 U2.53(CS27)
N$28: R47.1 U2.54(CS28)
N$29: R45.1 U2.56(CS29)
N$30: R44.1 U2.57(CS30)
N$31: R43.1 U2.58(CS31)
N$32: R41.1 U2.59(CS32)
N$33: R40.1 U2.60(CS33)
N$34: R39.1 U2.1(CS34)
N$35: R38.1 U2.2(CS35)
N$36: R37.1 U2.3(CS36)
N$37: R75.2 U2.13(RSET)
N$38: R76.1 U2.11(SDB)
N$39: R82.1 U2.4(CS37)
N$40: R81.1 U2.5(CS38)
N$41: R80.1 U2.6(CS39)
N$42: R22.1 U1.26(CS1)
N$43: R46.1 U1.11(SDB)
N$44: R42.2 U1.13(RSET)
N$45: R1.1 U1.27(CS2)
N$46: R2.1 U1.28(CS3)
N$47: R3.1 U1.29(CS4)
N$48: R23.1 U1.30(CS5)
N$49: R24.1 U1.31(CS6)
N$50: R25.1 U1.32(CS7)
N$51: R26.1 U1.33(CS8)
N$52: R27.1 U1.34(CS9)
N$53: R28.1 U1.35(CS10)
N$54: R29.1 U1.37(CS11)
N$55: R30.1 U1.38(CS12)
N$56: R31.1 U1.39(CS13)
N$57: R32.1 U1.40(CS14)
N$58: R33.1 U1.41(CS15)
N$59: R34.1 U1.42(CS16)
N$60: R35.1 U1.43(CS17)
N$61: R36.1 U1.44(CS18)
N$62: R21.1 U1.45(CS19)
N$63: R20.1 U1.46(CS20)
N$64: R19.1 U1.47(CS21)
N$65: R18.1 U1.48(CS22)
N$66: R17.1 U1.49(CS23)
N$67: R16.1 U1.50(CS24)
N$68: R15.1 U1.51(CS25)
N$69: R14.1 U1.52(CS26)
N$70: R13.1 U1.53(CS27)
N$71: R12.1 U1.54(CS28)
N$72: R11.1 U1.56(CS29)
N$73: R10.1 U1.57(CS30)
N$74: R9.1 U1.58(CS31)
N$75: R8.1 U1.59(CS32)
N$76: R7.1 U1.60(CS33)
N$77: R6.1 U1.1(CS34)
N$78: R5.1 U1.2(CS35)
N$79: R4.1 U1.3(CS36)
N$80: R79.1 U1.4(CS37)
N$81: R78.1 U1.5(CS38)
N$82: R77.1 U1.6(CS39)
N$84: LED617.C LED618.C LED619.C LED620.C LED621.C LED622.C LED623.C LED624.C R22.2
N$85: LED609.C LED610.C LED611.C LED612.C LED613.C LED614.C LED615.C LED616.C R1.2
N$86: LED601.C LED602.C LED603.C LED604.C LED605.C LED606.C LED607.C LED608.C R2.2
N$87: LED593.C LED594.C LED595.C LED596.C LED597.C LED598.C LED599.C LED600.C R3.2
N$88: LED585.C LED586.C LED587.C LED588.C LED589.C LED590.C LED591.C LED592.C R23.2
N$89: LED577.C LED578.C LED579.C LED580.C LED581.C LED582.C LED583.C LED584.C R24.2
N$90: LED569.C LED570.C LED571.C LED572.C LED573.C LED574.C LED575.C LED576.C R25.2
N$91: LED561.C LED562.C LED563.C LED564.C LED565.C LED566.C LED567.C LED568.C R26.2
N$92: LED553.C LED554.C LED555.C LED556.C LED557.C LED558.C LED559.C LED560.C R27.2
N$93: LED545.C LED546.C LED547.C LED548.C LED549.C LED550.C LED551.C LED552.C R28.2
N$94: LED537.C LED538.C LED539.C LED540.C LED541.C LED542.C LED543.C LED544.C R29.2
N$95: LED529.C LED530.C LED531.C LED532.C LED533.C LED534.C LED535.C LED536.C R30.2
N$96: LED521.C LED522.C LED523.C LED524.C LED525.C LED526.C LED527.C LED528.C R31.2
N$97: LED513.C LED514.C LED515.C LED516.C LED517.C LED518.C LED519.C LED520.C R32.2
N$98: LED505.C LED506.C LED507.C LED508.C LED509.C LED510.C LED511.C LED512.C R33.2
N$99: LED497.C LED498.C LED499.C LED500.C LED501.C LED502.C LED503.C LED504.C R34.2
N$100: LED489.C LED490.C LED491.C LED492.C LED493.C LED494.C LED495.C LED496.C R35.2
N$101: LED481.C LED482.C LED483.C LED484.C LED485.C LED486.C LED487.C LED488.C R36.2
N$102: LED473.C LED474.C LED475.C LED476.C LED477.C LED478.C LED479.C LED480.C R21.2
N$103: LED465.C LED466.C LED467.C LED468.C LED469.C LED470.C LED471.C LED472.C R20.2
N$104: LED457.C LED458.C LED459.C LED460.C LED461.C LED462.C LED463.C LED464.C R19.2
N$105: LED449.C LED450.C LED451.C LED452.C LED453.C LED454.C LED455.C LED456.C R18.2
N$106: LED441.C LED442.C LED443.C LED444.C LED445.C LED446.C LED447.C LED448.C R17.2
N$107: LED433.C LED434.C LED435.C LED436.C LED437.C LED438.C LED439.C LED440.C R16.2
N$108: LED425.C LED426.C LED427.C LED428.C LED429.C LED430.C LED431.C LED432.C R15.2
N$109: LED417.C LED418.C LED419.C LED420.C LED421.C LED422.C LED423.C LED424.C R14.2
N$110: LED409.C LED410.C LED411.C LED412.C LED413.C LED414.C LED415.C LED416.C R13.2
N$111: LED401.C LED402.C LED403.C LED404.C LED405.C LED406.C LED407.C LED408.C R12.2
N$112: LED393.C LED394.C LED395.C LED396.C LED397.C LED398.C LED399.C LED400.C R11.2
N$113: LED385.C LED386.C LED387.C LED388.C LED389.C LED390.C LED391.C LED392.C R10.2
N$114: LED377.C LED378.C LED379.C LED380.C LED381.C LED382.C LED383.C LED384.C R9.2
N$115: LED369.C LED370.C LED371.C LED372.C LED373.C LED374.C LED375.C LED376.C R8.2
N$116: LED361.C LED362.C LED363.C LED364.C LED365.C LED366.C LED367.C LED368.C R7.2
N$117: LED353.C LED354.C LED355.C LED356.C LED357.C LED358.C LED359.C LED360.C R6.2
N$118: LED345.C LED346.C LED347.C LED348.C LED349.C LED350.C LED351.C LED352.C R5.2
N$119: LED337.C LED338.C LED339.C LED340.C LED341.C LED342.C LED343.C LED344.C R4.2
N$120: LED329.C LED330.C LED331.C LED332.C LED333.C LED334.C LED335.C LED336.C R79.2
N$121: LED321.C LED322.C LED323.C LED324.C LED325.C LED326.C LED327.C LED328.C R78.2
N$122: LED313.C LED314.C LED315.C LED316.C LED317.C LED318.C LED319.C LED320.C R77.2
N$123: LED305.C LED306.C LED307.C LED308.C LED309.C LED310.C LED311.C LED312.C R57.2
N$124: LED297.C LED298.C LED299.C LED300.C LED301.C LED302.C LED303.C LED304.C R58.2
N$125: LED289.C LED290.C LED291.C LED292.C LED293.C LED294.C LED295.C LED296.C R59.2
N$126: LED281.C LED282.C LED283.C LED284.C LED285.C LED286.C LED287.C LED288.C R60.2
N$127: LED273.C LED274.C LED275.C LED276.C LED277.C LED278.C LED279.C LED280.C R61.2
N$128: LED265.C LED266.C LED267.C LED268.C LED269.C LED270.C LED271.C LED272.C R62.2
N$129: LED257.C LED258.C LED259.C LED260.C LED261.C LED262.C LED263.C LED264.C R63.2
N$130: LED249.C LED250.C LED251.C LED252.C LED253.C LED254.C LED255.C LED256.C R64.2
N$131: LED241.C LED242.C LED243.C LED244.C LED245.C LED246.C LED247.C LED248.C R65.2
N$132: LED233.C LED234.C LED235.C LED236.C LED237.C LED238.C LED239.C LED240.C R66.2
N$133: LED225.C LED226.C LED227.C LED228.C LED229.C LED230.C LED231.C LED232.C R67.2
N$134: LED217.C LED218.C LED219.C LED220.C LED221.C LED222.C LED223.C LED224.C R68.2
N$135: LED209.C LED210.C LED211.C LED212.C LED213.C LED214.C LED215.C LED216.C R69.2
N$136: LED201.C LED202.C LED203.C LED204.C LED205.C LED206.C LED207.C LED208.C R70.2
N$137: LED193.C LED194.C LED195.C LED196.C LED197.C LED198.C LED199.C LED200.C R71.2
N$138: LED185.C LED186.C LED187.C LED188.C LED189.C LED190.C LED191.C LED192.C R72.2
N$139: LED177.C LED178.C LED179.C LED180.C LED181.C LED182.C LED183.C LED184.C R73.2
N$140: LED169.C LED170.C LED171.C LED172.C LED173.C LED174.C LED175.C LED176.C R74.2
N$141: LED161.C LED162.C LED163.C LED164.C LED165.C LED166.C LED167.C LED168.C R56.2
N$142: LED153.C LED154.C LED155.C LED156.C LED157.C LED158.C LED159.C LED160.C R55.2
N$143: LED145.C LED146.C LED147.C LED148.C LED149.C LED150.C LED151.C LED152.C R54.2
N$144: LED137.C LED138.C LED139.C LED140.C LED141.C LED142.C LED143.C LED144.C R53.2
N$145: LED129.C LED130.C LED131.C LED132.C LED133.C LED134.C LED135.C LED136.C R52.2
N$146: LED121.C LED122.C LED123.C LED124.C LED125.C LED126.C LED127.C LED128.C R51.2
N$147: LED113.C LED114.C LED115.C LED116.C LED117.C LED118.C LED119.C LED120.C R50.2
N$148: LED105.C LED106.C LED107.C LED108.C LED109.C LED110.C LED111.C LED112.C R49.2
N$149: LED97.C LED98.C LED99.C LED100.C LED101.C LED102.C LED103.C LED104.C R48.2
N$150: LED89.C LED90.C LED91.C LED92.C LED93.C LED94.C LED95.C LED96.C R47.2
N$151: LED81.C LED82.C LED83.C LED84.C LED85.C LED86.C LED87.C LED88.C R45.2
N$152: LED73.C LED74.C LED75.C LED76.C LED77.C LED78.C LED79.C LED80.C R44.2
N$153: LED65.C LED66.C LED67.C LED68.C LED69.C LED70.C LED71.C LED72.C R43.2
N$154: LED57.C LED58.C LED59.C LED60.C LED61.C LED62.C LED63.C LED64.C R41.2
N$155: LED49.C LED50.C LED51.C LED52.C LED53.C LED54.C LED55.C LED56.C R40.2
N$156: LED41.C LED42.C LED43.C LED44.C LED45.C LED46.C LED47.C LED48.C R39.2
N$157: LED33.C LED34.C LED35.C LED36.C LED37.C LED38.C LED39.C LED40.C R38.2
N$158: LED25.C LED26.C LED27.C LED28.C LED29.C LED30.C LED31.C LED32.C R37.2
N$159: LED17.C LED18.C LED19.C LED20.C LED21.C LED22.C LED23.C LED24.C R82.2
N$160: LED9.C LED10.C LED11.C LED12.C LED13.C LED14.C LED15.C LED16.C R81.2
N$161: LED1.C LED2.C LED3.C LED4.C LED5.C LED6.C LED7.C LED8.C R80.2
N$162: LED316.A LED324.A LED332.A LED340.A LED348.A LED356.A LED364.A LED372.A LED380.A LED388.A LED396.A LED404.A LED412.A LED420.A LED428.A LED436.A LED444.A LED452.A LED460.A LED468.A LED476.A LED484.A LED492.A LED500.A LED508.A LED516.A LED524.A LED532.A LED540.A LED548.A LED556.A LED564.A LED572.A LED580.A LED588.A LED596.A LED604.A LED612.A LED620.A U1.20(SW5)
N$163: LED317.A LED325.A LED333.A LED341.A LED349.A LED357.A LED365.A LED373.A LED381.A LED389.A LED397.A LED405.A LED413.A LED421.A LED429.A LED437.A LED445.A LED453.A LED461.A LED469.A LED477.A LED485.A LED493.A LED501.A LED509.A LED517.A LED525.A LED533.A LED541.A LED549.A LED557.A LED565.A LED573.A LED581.A LED589.A LED597.A LED605.A LED613.A LED621.A U1.19(SW4)
N$164: LED318.A LED326.A LED334.A LED342.A LED350.A LED358.A LED366.A LED374.A LED382.A LED390.A LED398.A LED406.A LED414.A LED422.A LED430.A LED438.A LED446.A LED454.A LED462.A LED470.A LED478.A LED486.A LED494.A LED502.A LED510.A LED518.A LED526.A LED534.A LED542.A LED550.A LED558.A LED566.A LED574.A LED582.A LED590.A LED598.A LED606.A LED614.A LED622.A U1.18(SW3)
N$165: LED319.A LED327.A LED335.A LED343.A LED351.A LED359.A LED367.A LED375.A LED383.A LED391.A LED399.A LED407.A LED415.A LED423.A LED431.A LED439.A LED447.A LED455.A LED463.A LED471.A LED479.A LED487.A LED495.A LED503.A LED511.A LED519.A LED527.A LED535.A LED543.A LED551.A LED559.A LED567.A LED575.A LED583.A LED591.A LED599.A LED607.A LED615.A LED623.A U1.17(SW2)
N$166: LED320.A LED328.A LED336.A LED344.A LED352.A LED360.A LED368.A LED376.A LED384.A LED392.A LED400.A LED408.A LED416.A LED424.A LED432.A LED440.A LED448.A LED456.A LED464.A LED472.A LED480.A LED488.A LED496.A LED504.A LED512.A LED520.A LED528.A LED536.A LED544.A LED552.A LED560.A LED568.A LED576.A LED584.A LED592.A LED600.A LED608.A LED616.A LED624.A U1.16(SW1)
N$167: LED8.A LED16.A LED24.A LED32.A LED40.A LED48.A LED56.A LED64.A LED72.A LED80.A LED88.A LED96.A LED104.A LED112.A LED120.A LED128.A LED136.A LED144.A LED152.A LED160.A LED168.A LED176.A LED184.A LED192.A LED200.A LED208.A LED216.A LED224.A LED232.A LED240.A LED248.A LED256.A LED264.A LED272.A LED280.A LED288.A LED296.A LED304.A LED312.A U2.16(SW1)
N$168: LED7.A LED15.A LED23.A LED31.A LED39.A LED47.A LED55.A LED63.A LED71.A LED79.A LED87.A LED95.A LED103.A LED111.A LED119.A LED127.A LED135.A LED143.A LED151.A LED159.A LED167.A LED175.A LED183.A LED191.A LED199.A LED207.A LED215.A LED223.A LED231.A LED239.A LED247.A LED255.A LED263.A LED271.A LED279.A LED287.A LED295.A LED303.A LED311.A U2.17(SW2)
N$169: LED6.A LED14.A LED22.A LED30.A LED38.A LED46.A LED54.A LED62.A LED70.A LED78.A LED86.A LED94.A LED102.A LED110.A LED118.A LED126.A LED134.A LED142.A LED150.A LED158.A LED166.A LED174.A LED182.A LED190.A LED198.A LED206.A LED214.A LED222.A LED230.A LED238.A LED246.A LED254.A LED262.A LED270.A LED278.A LED286.A LED294.A LED302.A LED310.A U2.18(SW3)
N$170: LED5.A LED13.A LED21.A LED29.A LED37.A LED45.A LED53.A LED61.A LED69.A LED77.A LED85.A LED93.A LED101.A LED109.A LED117.A LED125.A LED133.A LED141.A LED149.A LED157.A LED165.A LED173.A LED181.A LED189.A LED197.A LED205.A LED213.A LED221.A LED229.A LED237.A LED245.A LED253.A LED261.A LED269.A LED277.A LED285.A LED293.A LED301.A LED309.A U2.19(SW4)
N$171: LED4.A LED12.A LED20.A LED28.A LED36.A LED44.A LED52.A LED60.A LED68.A LED76.A LED84.A LED92.A LED100.A LED108.A LED116.A LED124.A LED132.A LED140.A LED148.A LED156.A LED164.A LED172.A LED180.A LED188.A LED196.A LED204.A LED212.A LED220.A LED228.A LED236.A LED244.A LED252.A LED260.A LED268.A LED276.A LED284.A LED292.A LED300.A LED308.A U2.20(SW5)
N$172: LED3.A LED11.A LED19.A LED27.A LED35.A LED43.A LED51.A LED59.A LED67.A LED75.A LED83.A LED91.A LED99.A LED107.A LED115.A LED123.A LED131.A LED139.A LED147.A LED155.A LED163.A LED171.A LED179.A LED187.A LED195.A LED203.A LED211.A LED219.A LED227.A LED235.A LED243.A LED251.A LED259.A LED267.A LED275.A LED283.A LED291.A LED299.A LED307.A U2.21(SW6)
N$173: LED2.A LED10.A LED18.A LED26.A LED34.A LED42.A LED50.A LED58.A LED66.A LED74.A LED82.A LED90.A LED98.A LED106.A LED114.A LED122.A LED130.A LED138.A LED146.A LED154.A LED162.A LED170.A LED178.A LED186.A LED194.A LED202.A LED210.A LED218.A LED226.A LED234.A LED242.A LED250.A LED258.A LED266.A LED274.A LED282.A LED290.A LED298.A LED306.A U2.22(SW7)
N$174: LED1.A LED9.A LED17.A LED25.A LED33.A LED41.A LED49.A LED57.A LED65.A LED73.A LED81.A LED89.A LED97.A LED105.A LED113.A LED121.A LED129.A LED137.A LED145.A LED153.A LED161.A LED169.A LED177.A LED185.A LED193.A LED201.A LED209.A LED217.A LED225.A LED233.A LED241.A LED249.A LED257.A LED265.A LED273.A LED281.A LED289.A LED297.A LED305.A U2.23(SW8)
SCL: J4.2 U1.10(SCL) U2.10(SCL)
SDA: J4.1 U1.9(SDA) U2.9(SDA)
SW6: LED315.A LED323.A LED331.A LED339.A LED347.A LED355.A LED363.A LED371.A LED379.A LED387.A LED395.A LED403.A LED411.A LED419.A LED427.A LED435.A LED443.A LED451.A LED459.A LED467.A LED475.A LED483.A LED491.A LED499.A LED507.A LED515.A LED523.A LED531.A LED539.A LED547.A LED555.A LED563.A LED571.A LED579.A LED587.A LED595.A LED603.A LED611.A LED619.A U1.21(SW6)
SW7: LED314.A LED322.A LED330.A LED338.A LED346.A LED354.A LED362.A LED370.A LED378.A LED386.A LED394.A LED402.A LED410.A LED418.A LED426.A LED434.A LED442.A LED450.A LED458.A LED466.A LED474.A LED482.A LED490.A LED498.A LED506.A LED514.A LED522.A LED530.A LED538.A LED546.A LED554.A LED562.A LED570.A LED578.A LED586.A LED594.A LED602.A LED610.A LED618.A U1.22(SW7)
SW8: LED313.A LED321.A LED329.A LED337.A LED345.A LED353.A LED361.A LED369.A LED377.A LED385.A LED393.A LED401.A LED409.A LED417.A LED425.A LED433.A LED441.A LED449.A LED457.A LED465.A LED473.A LED481.A LED489.A LED497.A LED505.A LED513.A LED521.A LED529.A LED537.A LED545.A LED553.A LED561.A LED569.A LED577.A LED585.A LED593.A LED601.A LED609.A LED617.A U1.23(SW8)
VCC: C1.1 C2.1 C3.1 C4.1 C5.1 C6.1 C7.1 C8.1 C9.1 C10.1 C11.1 C12.1 J4.4 U1.14(AVCC) U1.15(PVCC1) U1.25(PVCC2) U2.14(AVCC) U2.15(PVCC1) U2.25(PVCC2) ; supply symbol labelled 5VDC
Unconnected: U1.7(INTB) U1.24(SW9) U2.7(INTB) U2.24(SW9)

## Buses
SCL,SDA

## Library data of the parts
C1-C12 = rcl:C-EU: CAPACITOR, European symbol; SPICEPREFIX: C
J1 = SparkFun-Connectors:CONN_02: Multi connection point. Often used as Generic Header-pin footprint for 0.1 inch spaced/style header connections On any of the 0.1 inch spaced packages, you can populate with these: Break Away Headers - Straight <https://www.sparkfun.com/products/116> (PRT-00116) Break Away Male Headers - Right Angle <https://www.sparkfun.com/products/553> (PRT-00553) Female Headers <https://www.sparkfun.com/products/115> (PRT-00115) Break Away Headers - Machine Pin <https://www.sparkfun.com/products/117> (PRT-00117) Break Away Female Headers - Swiss Machine Pin <https://www.sparkfun.com/products/743> (PRT-00743) For SCREWTERMINALS and SPRING TERMINALS visit here: Screw Terimnals on SparkFun.com <https://www.sparkfun.com/search/results?term=Screw+Terminals> (5mm/3.5mm/2.54mm spacing) This device is also useful as a general connection point to wire up your design to another part of your project. Our various solder wires solder well into these plated through hole pads. Hook-Up Wire - Assortment (Stranded, 22 AWG) <https://www.sparkfun.com/products/11375> (PRT-11375) Hook-Up Wire - Assortment (Solid Core, 22 AWG) <https://www.sparkfun.com/products/11367> (PRT-11367) View the entire wire category on our website here <https://www.sparkfun.com/categories/141> Special notes: Molex polarized connector foot print use with: PRT-08233 with associated crimp pins and housings. 2.54_SCREWTERM for use with PRT-10571. 3.5mm Screw Terminal footprints for PRT-08084 5mm Screw Terminal footprints for use with PRT-08432
J4 = SparkFun-Connectors:CONN_06: Multi connection point. Often used as Generic Header-pin footprint for 0.1 inch spaced/style header connections On any of the 0.1 inch spaced packages, you can populate with these: Break Away Headers - Straight <https://www.sparkfun.com/products/116> (PRT-00116) Break Away Male Headers - Right Angle <https://www.sparkfun.com/products/553> (PRT-00553) Female Headers <https://www.sparkfun.com/products/115> (PRT-00115) Break Away Headers - Machine Pin <https://www.sparkfun.com/products/117> (PRT-00117) Break Away Female Headers - Swiss Machine Pin <https://www.sparkfun.com/products/743> (PRT-00743) Arduino Stackable Header - 6 Pin <https://www.sparkfun.com/products/9280> (PRT-09280) For SCREWTERMINALS and SPRING TERMINALS visit here: Screw Terimnals on SparkFun.com <https://www.sparkfun.com/search/results?term=Screw+Terminals> (5mm/3.5mm/2.54mm spacing) This device is also useful as a general connection point to wire up your design to another part of your project. Our various solder wires solder well into these plated through hole pads. Hook-Up Wire - Assortment (Stranded, 22 AWG) <https://www.sparkfun.com/products/11375> (PRT-11375) Hook-Up Wire - Assortment (Solid Core, 22 AWG) <https://www.sparkfun.com/products/11367> (PRT-11367) View the entire wire category on our website here <https://www.sparkfun.com/categories/141>
LED1-LED624 = adafruit:LED: LED OSRAM: - CHIPLED LG R971, LG N971, LY N971, LG Q971, LY Q971, LO R971, LY R971 LH N974, LH R974 LS Q976, LO Q976, LY Q976 LO Q996 - Hyper CHIPLED LW Q18S LB Q993, LB Q99A, LB R99A - SideLED LS A670, LO A670, LY A670, LG A670, LP A670 LB A673, LV A673, LT A673, LW A673 LH A674 LY A675 LS A676, LA A676, LO A676, LY A676, LW A676 LS A679, LY A679, LG A679 - Hyper Micro SIDELED® LS Y876, LA Y876, LO Y876, LY Y876 LT Y87S - SmartLED LW L88C, LW L88S LB L89C, LB L89S, LG L890 LS L89K, LO L89K, LY L89K LS L896, LA L896, LO L896, LY L896 - TOPLED LS T670, LO T670, LY T670, LG T670, LP T670 LSG T670, LSP T670, LSY T670, LOP T670, LYG T670 LG T671, LOG T671, LSG T671 LB T673, LV T673, LT T673, LW T673 LH T674 LS T676, LA T676, LO T676, LY T676, LB T676, LH T676, LSB T676, LW T676 LB T67C, LV T67C, LT T67C, LS T67K, LO T67K, LY T67K, LW E67C LS E67B, LA E67B, LO E67B, LY E67B, LB E67C, LV E67C, LT E67C LW T67C LS T679, LY T679, LG T679 LS T770, LO T770, LY T770, LG T770, LP T770 LB T773, LV T773, LT T773, LW T773 LH T774 LS E675, LA E675, LY E675, LS T675 LS T776, LA T776, LO T776, LY T776, LB T776 LHGB T686 LT T68C, LB T68C - Hyper Mini TOPLED® LB M676 - Mini TOPLED Santana® LG M470 LS M47K, LO M47K, LY M47K Source: http://www.osram.convergy.de/
R1-R45 R47-R75 R77-R82 = rcl:R-US_: RESISTOR, American symbol; SPICEPREFIX: R
R46 R76 = rcl:R-EU_: RESISTOR, European symbol; SPICEPREFIX: R
U1 U2 = MRRobotBadge:IS31FL3741_QFN60: ISSI IS31FL3741 QFN-60